# EAGLE design imu (EAGLE 6.4)
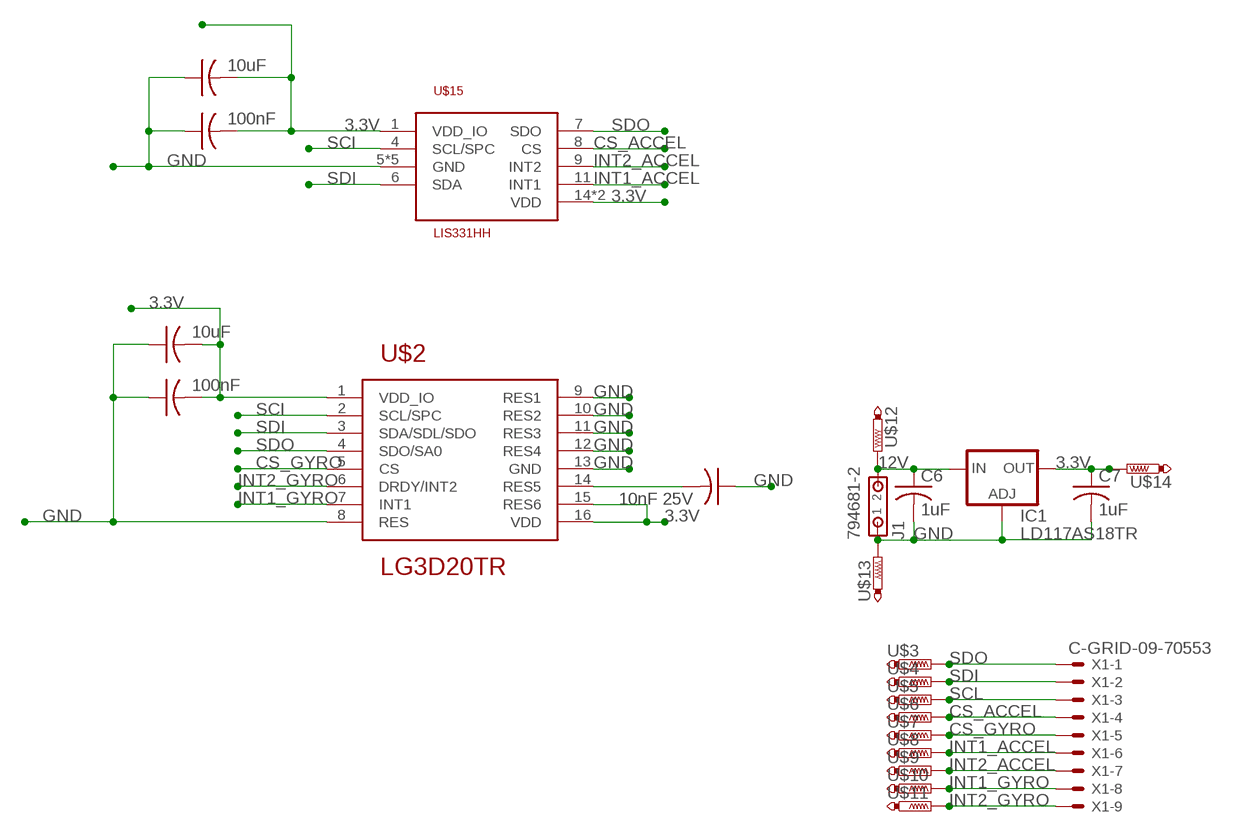
[diagram p0: schematic, sheet 1]

## Parts
C1_1  10nF 25V  C-USC1206  [C1206]
C2_1  10uF  C-USC1206  [C1206]
C3_1  100nF  C-USC1206  [C1206]
C4_1  10uF  C-USC1206  [C1206]
C5_1  100nF  C-USC1206  [C1206]
C6  1uF  C-USC1206  [C1206]
C7  1uF  C-USC1206  [C1206]
IC1  LD117AS18TR  [SOT223]
J1  794681-2  [794681-2]
U$2  LG3D20TR  [L3GD20TR]
U$3  TESTPAD-20MIL  [20MIL]
U$4  TESTPAD-20MIL  [20MIL]
U$5  TESTPAD-20MIL  [20MIL]
U$6  TESTPAD-20MIL  [20MIL]
U$7  TESTPAD-20MIL  [20MIL]
U$8  TESTPAD-20MIL  [20MIL]
U$9  TESTPAD-20MIL  [20MIL]
U$10  TESTPAD-20MIL  [20MIL]
U$11  TESTPAD-20MIL  [20MIL]
U$12  TESTPAD-20MIL  [20MIL]
U$13  TESTPAD-20MIL  [20MIL]
U$14  TESTPAD-20MIL  [20MIL]
U$15  LIS331HH  [LIS331HH]
X1  C-GRID-09-70553  [70553-09]

## Nets
3.3V: C2_1.2 C3_1.2 C4_1.2 C5_1.2 C7.1 IC1.4(OUT) U$2.1(VDD_IO) U$2.15(RES6) U$2.16(VDD) U$14.P$1(TP) U$15.1(VDD_IO) U$15.14(VDD) U$15.15(VDD)
12V: C6.1 IC1.3(IN) J1.2 U$12.P$1(TP)
CS_ACCEL: U$6.P$1(TP) U$15.8(CS) X1.4
CS_GYRO: U$2.5(CS) U$7.P$1(TP) X1.5
GND: C1_1.1 C2_1.1 C3_1.1 C4_1.1 C5_1.1 C6.2 C7.2 IC1.1(ADJ) J1.1 U$2.8(RES) U$2.9(RES1) U$2.10(RES2) U$2.11(RES3) U$2.12(RES4) U$2.13(GND) U$13.P$1(TP) U$15.5(GND) U$15.10(GND) U$15.12(GND) U$15.13(GND) U$15.16(GND)
INT1_ACCEL: U$8.P$1(TP) U$15.11(INT1) X1.6
INT1_GYRO: U$2.7(INT1) U$10.P$1(TP) X1.8
INT2_ACCEL: U$9.P$1(TP) U$15.9(INT2) X1.7
INT2_GYRO: U$2.6(DRDY/INT2) U$11.P$1(TP) X1.9
SCI: U$2.2(SCL/SPC) U$15.4(SCL/SPC)
SCL: U$5.P$1(TP) X1.3
SDI: U$2.3(SDA/SDL/SDO) U$4.P$1(TP) U$15.6(SDA) X1.2
SDO: U$2.4(SDO/SA0) U$3.P$1(TP) U$15.7(SDO) X1.1
VOUT: C1_1.2 U$2.14(RES5)

## Library data of the parts
C1_1 C2_1 C3_1 C4_1 C5_1 C6 C7 = rcl:C-US: CAPACITOR, American symbol
IC1 = v-reg:LD117A?*: Low drop fixed and adjustable positive voltage regulators 1 A Source: http://www.st.com/stonline/products/literature/ds/7194/ld1117axx.pdf
J1 = con-amp:794681-2: Micro MATE-N-LOK Connectors grid 1.5mm Dual Row Through Hole Vertical Metal Through Hole Holddowns Source: ENG_CD_794681_E.pdf
U$2 = LTC6803:LG3D20TR
U$3-U$14 = LTC6803:TESTPAD-20MIL
U$15 = LIS331HH:LIS331HH
X1 = con-molex:C-GRID-09: CONNECTOR wire to board 2.54 mm (0.100") pitch header; OC_FARNELL: unknown; OC_NEWARK: unknown

## Board
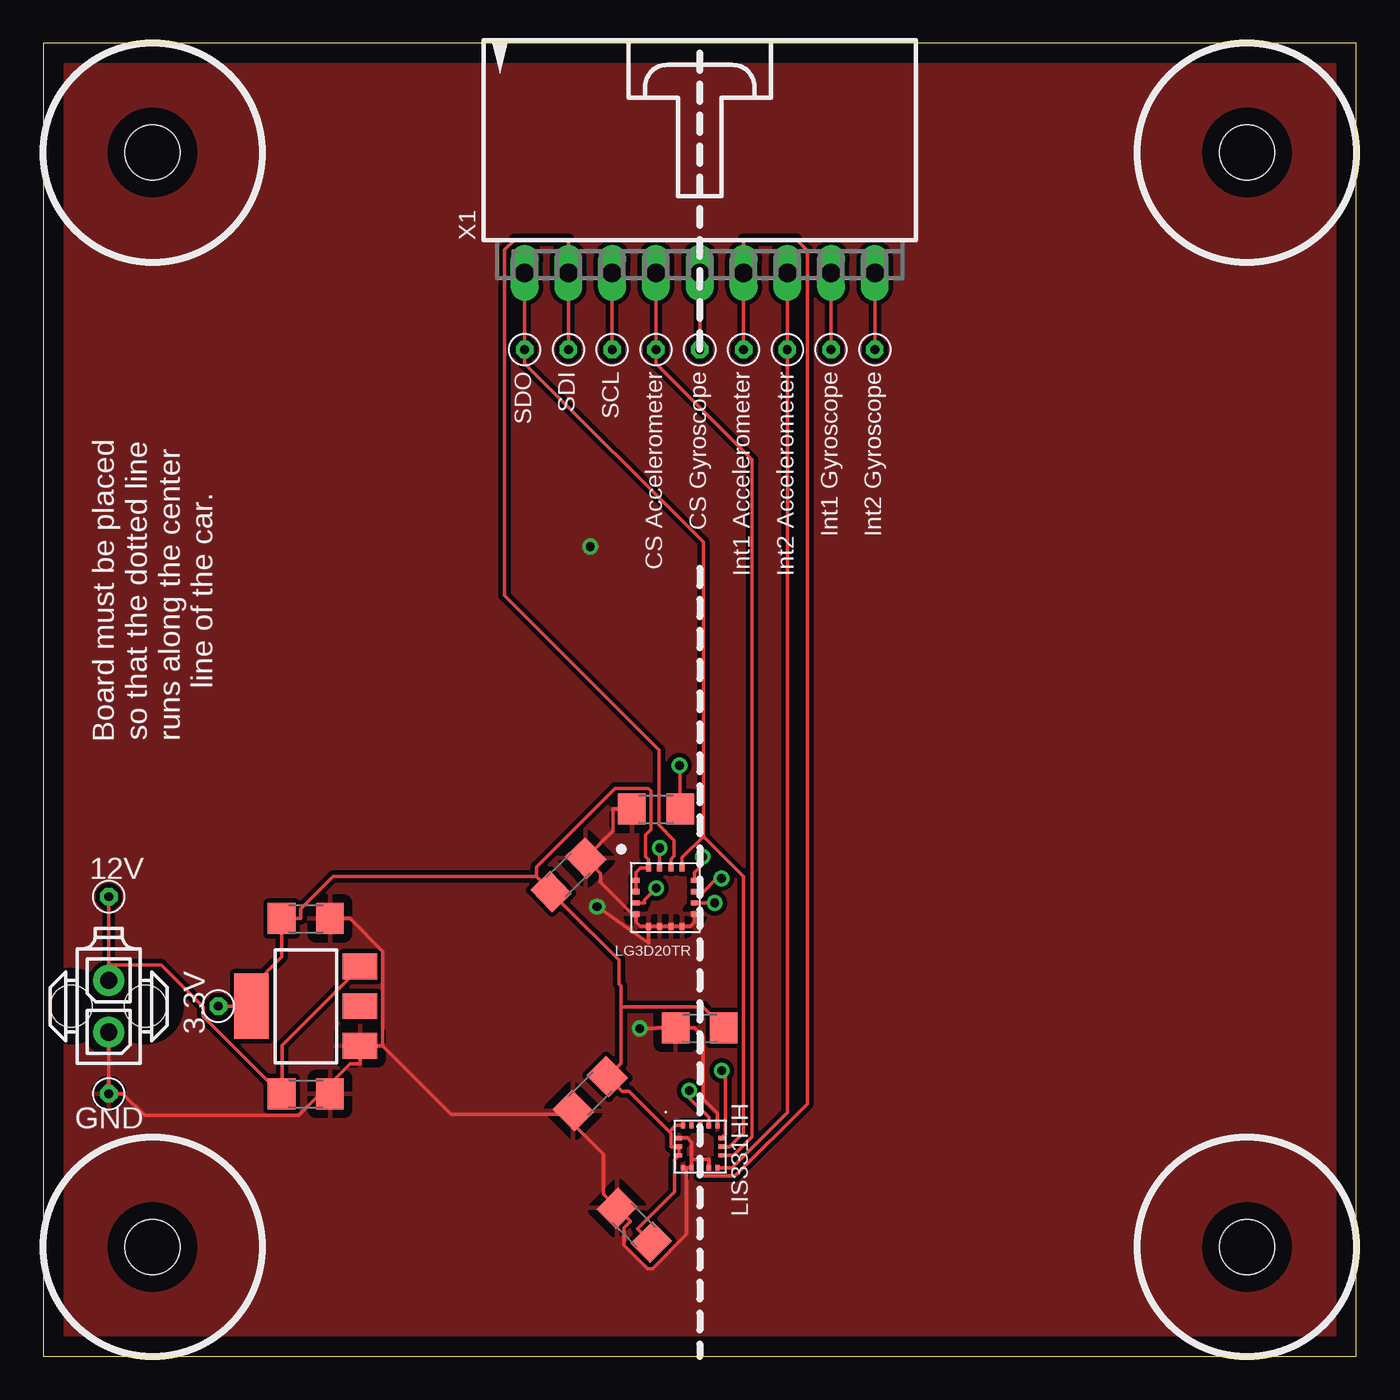
[diagram p1: board, top side]
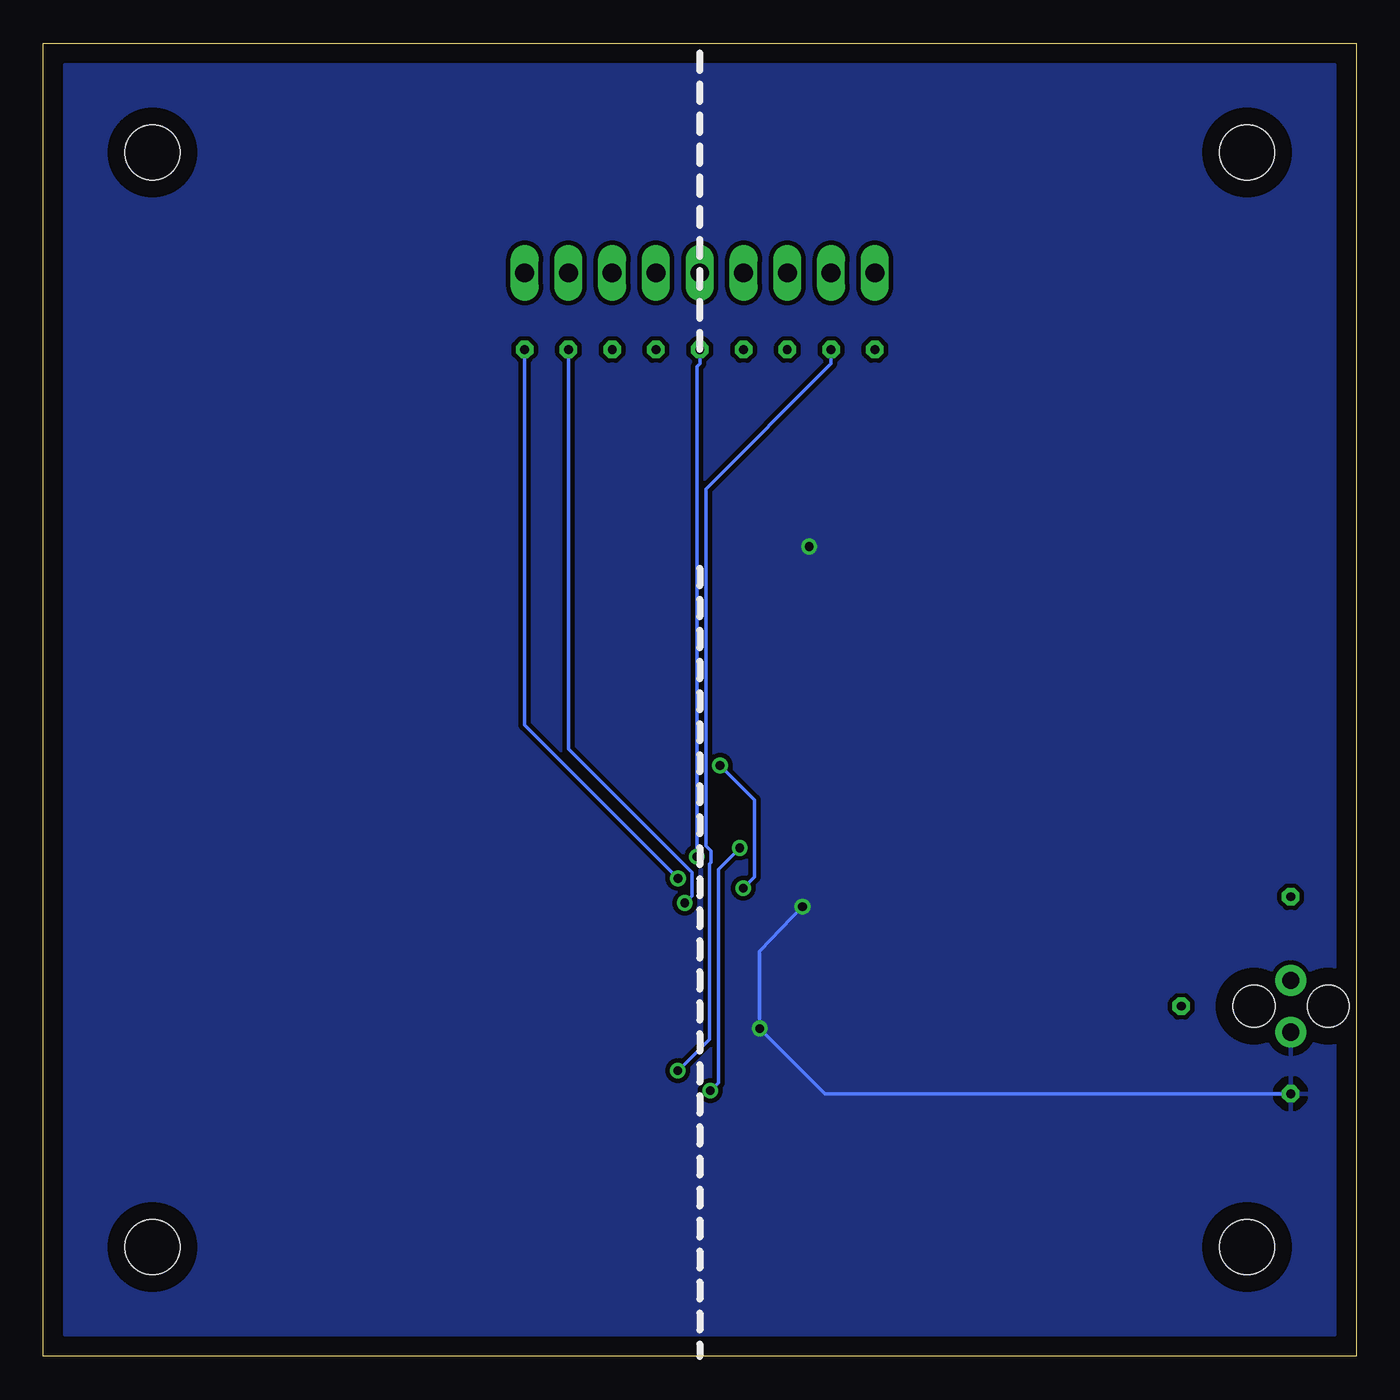
[diagram p2: board, bottom side, seen from below]

Size 76.2 x 76.2 mm. Coordinates in mm from the lower left corner, seen from the top.
Outline: 0,0 76.2,0 76.2,76.2 0,76.2 0,0
Copper layers (1*16): Top 0.035mm / dielectric 1.5mm / Bottom 0.035mm
Design rules "SJ Design Rules *": minimum track width 8mil, minimum drill 20mil, track to track 10mil, track to pad 8mil, pad to pad 8mil, via to via 10mil, smd to smd 8mil, copper to edge 40mil, drill to drill 10mil, minimum pad ring 10mil, minimum via ring 8mil, stop-mask expansion 4mil, vias tented up to drill 0mil, thermal gap 20mil
Holes 3.17 mm at 6.35,6.35 69.85,69.85 6.35,69.85 69.85,6.35

### Footprints (pad centres in the part's own frame; a part is rotated, then mirrored left to right if it is on the bottom)
C1206 = smd 1.6 x 1.8: 1 -1.4,0; 2 1.4,0
SOT223 = smd 1.5 x 2: 1 -2.3,-3.15; 2 0,-3.15; 3 2.3,-3.15 | smd 3.8 x 2: 4 0,3.15
794681-2 = drill 1 pad 1.778: 1 0,-1.5; 2 0,1.5 | hole 2.4: 2.13,0; -2.17,0
L3GD20TR = smd 0.399 x 0.3: 1 3.7,2.975; 2 3.7,2.325; 3 3.7,1.675; 4 3.7,1.025; 9 0.3,1.025; 10 0.3,1.675; 11 0.3,2.325; 12 0.3,2.975 | smd 0.3 x 0.399: 5 2.975,0.3; 6 2.325,0.3; 7 1.675,0.3; 8 1.025,0.3; 13 1.025,3.7; 14 1.675,3.7; 15 2.325,3.7; 16 2.975,3.7
20MIL = drill 0.508 octagon: P$1 0,0
LIS331HH = smd 0.35 x 0.25: 1 2.725,2.5; 2 2.725,2; 3 2.725,1.5; 4 2.725,1; 5 2.725,0.5; 9 0.275,0.5; 10 0.275,1; 11 0.275,1.5; 12 0.275,2; 13 0.275,2.5 | smd 0.25 x 0.35: 6 2,0.275; 7 1.5,0.275; 8 1,0.275; 14 1,2.725; 15 1.5,2.725; 16 2,2.725
70553-09 = drill 1.092 long: 1 -10.16,-7.62; 2 -7.62,-7.62; 3 -5.08,-7.62; 4 -2.54,-7.62; 5 0,-7.62; 6 2.54,-7.62; 7 5.08,-7.62; 8 7.62,-7.62; 9 10.16,-7.62

### Placement (x,y rotation side)
C1_1  35.56,31.75 0 top
C2_1  38.1,19.05 0 top
C3_1  30.48,27.94 224 top
C4_1  34.29,7.62 315 top
C5_1  31.75,15.24 45 top
C6  15.24,15.24 0 top
C7  15.24,25.4 0 top
IC1  15.24,20.32 90 top
J1  3.81,20.32 0 top
U$2  38.1,24.64 90 top
U$3  27.94,58.42 0 top
U$4  30.48,58.42 0 top
U$5  33.02,58.42 0 top
U$6  35.56,58.42 0 top
U$7  38.1,58.42 0 top
U$8  40.64,58.42 0 top
U$9  43.18,58.42 0 top
U$10  45.72,58.42 0 top
U$11  48.26,58.42 0 top
U$12  3.81,26.67 0 top
U$13  3.81,15.24 0 top
U$14  10.16,20.32 0 top
U$15  39.62,10.67 90 top
X1  38.1,70.48 0 top

### Tracks (layer width: path | path; a pad name or v marks a point on that pad's centre or on a via)
3.3V
  Top 0.203: 33.52,20.27 33.52,17.01 32.75,16.24 | 33.52,20.27 33.52,21.5 33.41,21.61 33.41,23 30.32,26.09 C3_1.2 | 33.52,20.27 38.27,20.27 C2_1.2 | 28.62,27.85 28.62,28.41 33.17,32.95 35.11,32.95 35.27,32.8 35.27,30.58 34.95,30.27 34.95,29.02 35.12,28.84 U$2.1 | 28.62,27.85 16.84,27.85 14.95,25.95 14.95,25.4 C7.1 13.84,23.17 12.09,21.42 12.09,20.87 | C3_1.2 28.62,27.85 | C3_1.2 | U$2.1 | U$2.1 34.67,28.34 34.4,28.07 34.4,27.66 | U$2.16 34.4,27.66 | U$2.16 34.4,27.39 34.4,27.16 34.4,26.98 | U$2.16 | U$2.15 | U$2.15 34.4,26.98 | 36.66,12.17 36.73,12.1 36.9,12.1 U$15.14 36.65,11.42 36.65,9.56 34.5,7.41 C4_1.2 | 36.66,12.17 36.42,12.17 36.42,12.96 36.34,13.04 | U$15.15 36.66,12.17 | 36.34,13.04 34,15.38 33.59,15.38 C5_1.2 | 36.34,13.04 36.69,13.39 U$15.1 | C5_1.2 | C5_1.2 32.75,16.24 | U$14.P$1 10.97,20.32 11.52,20.87 12.09,20.87 | IC1.4 12.09,20.87 | U$2.15 34.44,26.98 34.4,26.98 | C3_1.2 29.49,26.98 C3_1.2 | U$2.16 34.44,27.66 34.4,27.66 | U$2.1 | C4_1.2 | C5_1.2 32.77,16.23 32.75,16.24
12V
  Top 0.203: U$12.P$1 3.81,21.87 J1.2 3.89,22.71 6.86,22.71 9.3,20.27 9.3,19.74 13.79,15.24 C6.1 13.87,15.24 13.87,18.06 18.36,22.55 IC1.3
CS_ACCEL
  Top 0.203: U$15.8 40.05,11.67 41.12,12.74 41.12,52.05 35.56,57.61 U$6.P$1 X1.4
CS_GYRO  (via drill 0.51 pad 0.91)
  Top 0.203: U$2.5 37.8,28.07 38.27,28.54 v38.27,28.99 | X1.5 U$7.P$1
  Bottom 0.203: U$7.P$1 38.1,57.61 38.27,57.43 v38.27,28.99
GND  (via drill 0.51 pad 0.91)
  Top 0.203: C3_1.1 31.53,28.87 | 31.53,28.87 32.34,28.03 32.34,27.5 34.4,25.43 | 34.4,25.43 34.4,25.21 34.67,24.94 U$2.12 | U$2.13 34.4,25.43 | U$2.12 35.12,24.92 | 35.12,24.92 35.12,24 v32.14,26.09 | 19.7,18.02 19.7,23.51 17.8,25.4 C7.2 | 30.57,14.05 23.66,14.05 19.7,18.02 | v34.62,19.02 35.57,19.02 35.59,19.05 C2_1.1 37.8,19.05 38.3,18.56 38.3,14.93 39.12,14.1 U$15.5 | C3_1.1 32.3,29.7 | 16.09,15.24 14.83,13.98 5.88,13.98 4.62,15.24 U$13.P$1 J1.1 | 16.09,15.24 17.81,16.96 18.39,16.96 IC1.1 19.7,18.02 | C6.2 16.09,15.24 | 30.57,14.05 30.37,13.86 32.52,11.71 32.52,9.39 C4_1.1 | C5_1.1 | C5_1.1 30.57,14.05 | 37.34,10.94 U$15.12 37.62,11.42 | 37.34,10.94 37.34,7.07 35.35,5.09 35.07,5.09 33.72,6.44 33.72,7.47 34.08,7.83 C4_1.1 | 37.62,11.42 37.62,12.42 37.38,12.67 U$15.16 | 37.62,11.42 38.62,11.42 U$15.10 | U$15.13 37.34,10.94 | U$2.11 | U$2.11 35.74,24.94 | 35.74,24.94 35.58,24.94 U$2.12 | U$2.12 | 32.3,29.7 32.3,29.72 33.05,30.48 33.05,31.75 C1_1.1 | 32.3,29.7 | C4_1.1 | C4_1.1 | U$2.9 37.53,24.94 | U$2.10 | U$2.10 U$2.9 | U$2.9 | 37.53,24.94 | 37.53,24.94 37.8,25.21 U$2.8 | U$2.11 U$2.10 | U$2.10 | U$2.12 35.13,24.92 35.12,24.92 | 35.74,24.94 35.74,24.92 U$2.11 | U$2.13 34.44,25.68 U$2.13 | U$2.10 36.42,24.92 U$2.10 | U$2.9 37.11,24.92 U$2.9 | C5_1.1 30.79,14.25 C5_1.1 | C4_1.1 | C3_1.1 31.55,28.88 31.53,28.87
  Bottom 0.203: v32.14,26.09 34.62,23.5 v34.62,19.02 30.84,15.24 U$13.P$1
  other vias: 31.75,46.99
  pour Top: 1.27,74.93 1.27,1.27 74.93,1.27 74.93,74.93
  pour Bottom: 1.27,74.93 1.27,1.27 74.93,1.27 74.93,74.93
INT1_ACCEL
  Top 0.203: U$15.11 38.12,10.46 40.15,10.46 44.35,14.67 44.35,64.17 43.72,64.81 40.64,64.81 X1.6 U$8.P$1
INT1_GYRO  (via drill 0.51 pad 0.91)
  Top 0.203: v38.97,26.31 38.31,26.31 38.3,26.31 U$2.7 | U$10.P$1 X1.8
  Bottom 0.203: v38.97,26.31 38.55,26.73 38.55,28.07 45.72,35.24 45.72,57.61 U$10.P$1
INT2_ACCEL
  Top 0.203: X1.7 U$9.P$1 43.18,14.15 39.98,10.94 39.55,10.94 U$15.9
INT2_GYRO  (via drill 0.51 pad 0.91)
  Top 0.203: v39.36,27.74 39.08,27.74 38.3,26.96 U$2.6 | X1.9 U$11.P$1
  Bottom 0.203: U$11.P$1 48.26,36.63 v39.36,27.74
SCI  (via drill 0.51 pad 0.91)
  Top 0.203: U$15.4 38.62,13.87 37.48,15.01 v37.48,15.42 | U$2.2 35.81,28.35 U$2.2 | U$2.2 v35.77,29.5
  Bottom 0.203: v35.77,29.5 37.03,28.25 37.03,15.88 v37.48,15.42
SCL
  Top 0.203: X1.3 U$5.P$1
SDI  (via drill 0.51 pad 0.91)
  Top 0.203: v39.37,16.57 39.59,16.36 39.59,12.91 U$15.6 | U$2.3 | U$2.3 36.42,28.84 36.62,29.04 36.62,29.93 35.72,30.82 35.72,35.2 26.78,44.14 26.78,64.21 27.38,64.81 30.48,64.81 X1.2 U$4.P$1
  Bottom 0.203: v39.37,16.57 37.54,18.41 37.54,28.57 37.46,28.66 37.46,29.33 37.75,29.62 37.75,50.34 30.48,57.61 U$4.P$1
SDO
  Top 0.203: 38.3,30.17 37.08,28.94 U$2.4 | U$2.4 37.11,28.35 U$2.4 | 38.3,30.17 38.3,47.24 27.94,57.61 U$3.P$1 X1.1 | 38.3,30.17 40.63,27.84 40.63,12.97 39.83,12.17 U$15.7
VOUT  (via drill 0.51 pad 0.91)
  Top 0.203: 34.44,26.31 U$2.14 34.44,26.29 34.44,26.31 | 34.44,26.31 34.9,26.31 34.9,26.49 v35.58,27.16 | v36.92,34.29 36.96,34.26 C1_1.2
  Bottom 0.203: v35.58,27.16 34.93,27.81 34.93,32.3 v36.92,34.29

### Text on the board
tPlace: SDO / SDI / SCL / CS Accelerometer / CS Gyroscope / Int1 Accelerometer / Int2 Accelerometer / Int1 Gyroscope / Int2 Gyroscope | Board must be placed / so that the dotted line / runs along the center / line of the car. | 12V | 3.3V | GND
tValues: Inertial Measurement Unit
bValues: REV1 4/22/2013